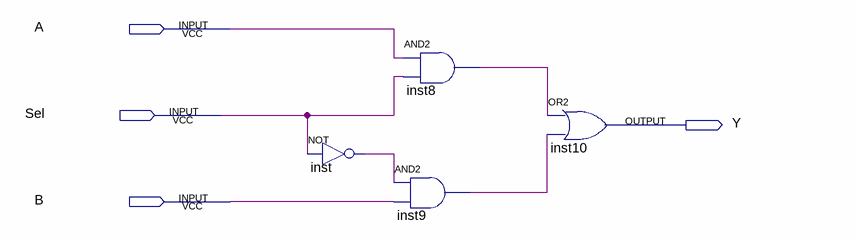
[diagram p0: schematic sheet]
// Quartus schematic mux2to1.bdf as structural Verilog: 4 symbols, 4 pins
module mux2to1 (
  input  A,
  input  Sel,
  input  B,
  output Y
);

  wire inst8_out, inst9_out, inst_out;

  not inst (inst_out, Sel);
  and inst8 (inst8_out, A, Sel);
  and inst9 (inst9_out, inst_out, B);
  or inst10 (Y, inst8_out, inst9_out);
endmodule
